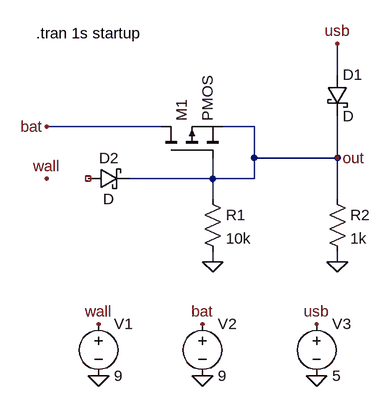
[diagram p0: schematic power.asc]
power.asc, the LTspice schematic file:
Version 4
SHEET 1 880 680
WIRE 432 32 432 -16
WIRE 160 112 -16 112
WIRE 304 112 256 112
WIRE 304 160 304 112
WIRE 432 160 432 96
WIRE 432 160 304 160
WIRE 240 192 240 160
WIRE 240 192 112 192
WIRE 304 192 304 160
WIRE 304 192 240 192
WIRE 240 224 240 192
WIRE 432 224 432 160
WIRE 240 320 240 304
WIRE 432 320 432 304
FLAG 240 320 0
FLAG 432 320 0
FLAG 64 496 0
FLAG 224 496 0
FLAG 400 496 0
FLAG 64 416 wall
FLAG 224 416 bat
FLAG 400 416 usb
FLAG 432 -16 usb
FLAG -16 112 bat
FLAG -16 192 wall
FLAG 432 160 out
SYMBOL pmos 160 160 R270
SYMATTR InstName M1
SYMBOL res 224 208 R0
SYMATTR InstName R1
SYMATTR Value 10k
SYMBOL res 416 208 R0
SYMATTR InstName R2
SYMATTR Value 1k
SYMBOL schottky 416 32 R0
SYMATTR InstName D1
SYMBOL schottky 48 208 R270
WINDOW 0 32 32 VTop 2
WINDOW 3 0 32 VBottom 2
SYMATTR InstName D2
SYMBOL voltage 64 400 R0
WINDOW 123 0 0 Left 0
WINDOW 39 0 0 Left 0
SYMATTR InstName V1
SYMATTR Value 9
SYMBOL voltage 224 400 R0
WINDOW 123 0 0 Left 0
WINDOW 39 0 0 Left 0
SYMATTR InstName V2
SYMATTR Value 9
SYMBOL voltage 400 400 R0
WINDOW 123 0 0 Left 0
WINDOW 39 0 0 Left 0
SYMATTR InstName V3
SYMATTR Value 5
TEXT -32 -32 Left 2 !.tran 1s startup

The netlist it stands for:
* power.asc
M1 bat out out out PMOS
R1 out 0 10k
R2 out 0 1k
D1 usb out D
D2 NC_01 out D
V1 wall 0 9
V2 bat 0 9
V3 usb 0 5
.model D D
.lib standard.dio
.model NMOS NMOS
.model PMOS PMOS
.lib standard.mos
.tran 1s startup
.backanno
.end